# Altium schematic sheet 1_Overview.SchDoc: Block Diagram Overview
size A; Date: 12/31/2025; Author: Praveen Perera; DrawnBy: Praveen Perera; Engineer: Praveen Perera; Revision: 0; SheetNumber: 1; SheetTotal: 9
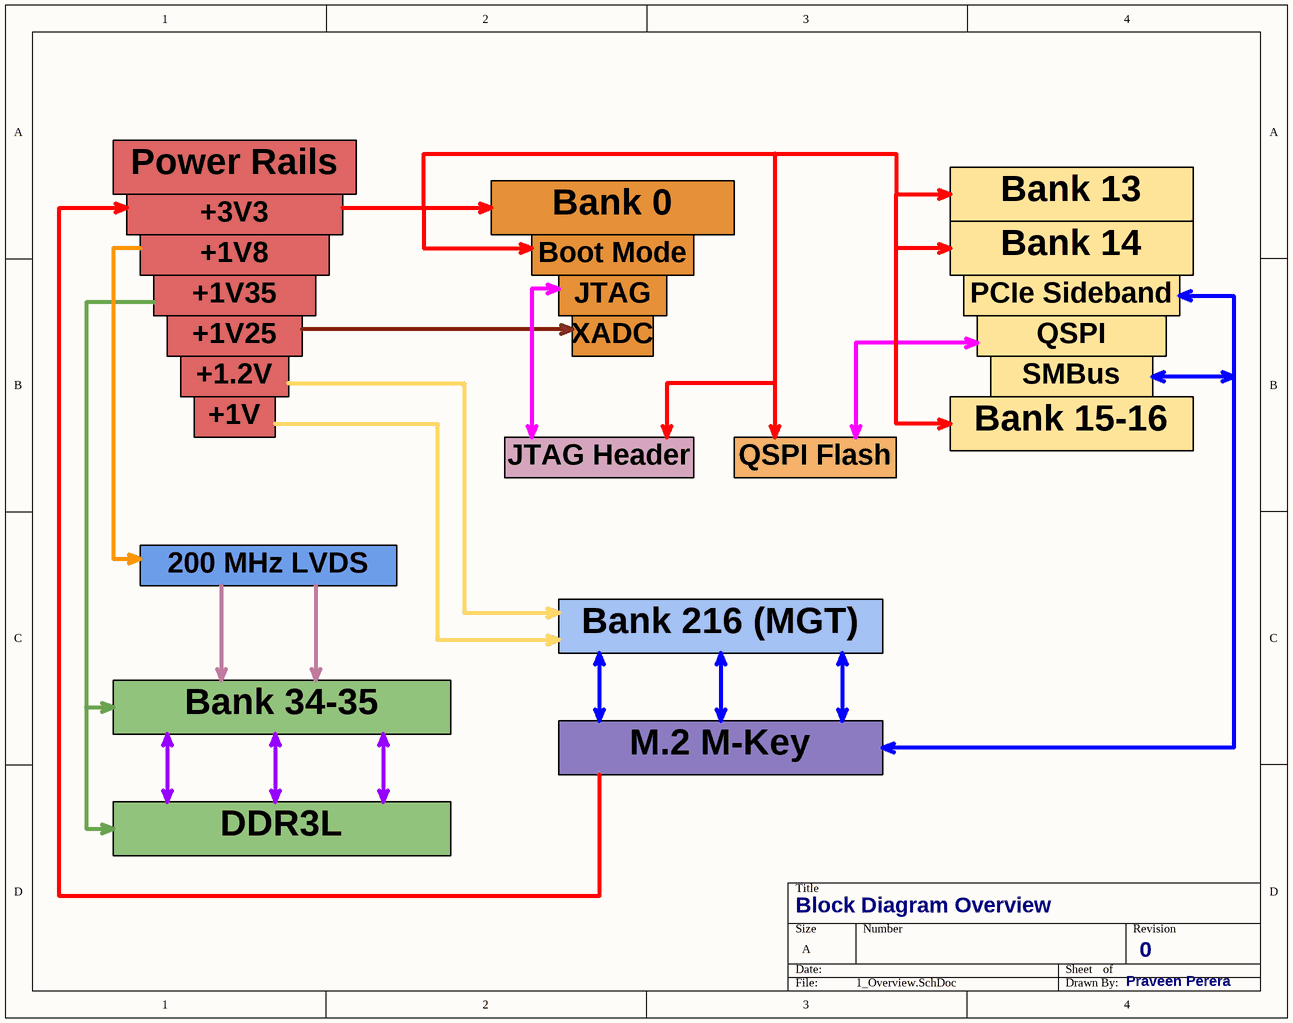
[diagram p0: 1_Overview.SchDoc]

## Notes on the sheet
- Power Rails
- +3V3
- Bank 0
- Bank 13
- +1V8
- Boot Mode
- Bank 14
- +1V35
- +1V25
- JTAG
- XADC
- PCIe Sideband
- QSPI
- +1.2V
- +1V
- SMBus
- JTAG Header
- QSPI Flash
- Bank 15-16
- 200 MHz LVDS CLK
- Bank 216 (MGT)
- Bank 34-35 (DDR3L)
- M.2 M-Key
- DDR3L